# Altium project breakout_boards.PrjPcb
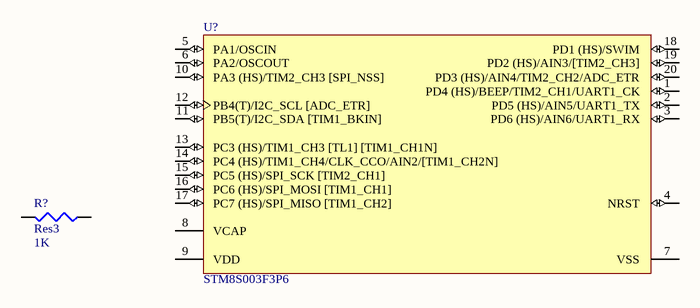
[diagram p0: Sheet1.SchDoc]
2 sheets, 3 parts. Net scope: global (net labels, ports and power ports of the same name join across sheets).
Board file: PCB1.PcbDoc
Sheets:
  Sheet1.SchDoc
  Sheet2.SchDoc

## Sheet Sheet1.SchDoc
size A4; SheetNumber: 1; SheetTotal: 2

### Parts
(Parts that share a designator on the sheet are numbered #1, #2 ... from top to bottom, then left to right.)
R?  Res3  value 1K  [J1-0603]
U?#1  STM8S003F3P6  [STM-TSSOP20_V]

### Nets

Not connected (* = marked no-connect by the designer): R? 1 2; U?#1 1(PD4_(HS)/BEEP/TIM2_CH1/UART1_CK) 2(PD5_(HS)/AIN5/UART1_TX) 3(PD6_(HS)/AIN6/UART1_RX) 4(NRST) 5(PA1/OSCIN) 6(PA2/OSCOUT) 7(VSS) 8(VCAP) 9(VDD) 10(PA3_(HS)/TIM2_CH3_[SPI_NSS]) 11(PB5(T)/I2C_SDA_[TIM1_BKIN]) 12(PB4(T)/I2C_SCL_[ADC_ETR]) 13(PC3_(HS)/TIM1_CH3_[TL1]_[TIM1_CH1N]) 14(PC4_(HS)/TIM1_CH4/CLK_CCO/AIN2/[TIM1_CH2N]) 15(PC5_(HS)/SPI_SCK_[TIM2_CH1]) 16(PC6_(HS)/SPI_MOSI_[TIM1_CH1]) 17(PC7_(HS)/SPI_MISO_[TIM1_CH2]) 18(PD1_(HS)/SWIM) 19(PD2_(HS)/AIN3/[TIM2_CH3]) 20(PD3_(HS)/AIN4/TIM2_CH2/ADC_ETR)

### Library data of the parts
R? = Res3: Resistor; Published: 8-Jun-2000; LatestRevisionDate: 29-May-2009; LatestRevisionNote: IPC-7351 Footprint Added.; PackageReference: J1-0603; Publisher: Altium Limited; PackageDescription: Chip Resistor
U?#1 = CMP-2000-07166-1: Value Line, 16 MHz STM8S 8-Bit MCU, 8 Kbyte Flash, 128 Byte Data EEPROM, 10-Bit ADC, 3 Timers, 2.95 to 5.5 V, -40 to 85 degC, 20-Pin TSSOP, RoHS, Tube; Manufacturer: STMicroelectronics; Connectivity: I²C,IrDA,LIN,SPI,UART/USART; Featured Product: FlasherSeriesofProductionTools; Program Memory Size: 8KB(8Kx8); Oscillator Type: Internal; Other Names: 497-11946-5; Core Processor: STM8; Package Version: Rev. 2, 01/2015; Peripherals: Brown-outDetect/Reset,POR,PWM,WDT; Data Converters: A/D5x10b; Other Related Documents: STM8S003F3ViewAllSpecifications; Number of I/Os: 16; EEPROM Size: 128x8; Speed: 16MHz; RAM Size: 1Kx8; Voltage - Supply (Vcc/Vdd): 2.95V~5.5V; Series: STM8S; Category: IntegratedCircuits(ICs); Program Memory Type: FLASH; Packaging: Tube; Datasheet Version: Rev. 8, 04/2016; Manufacturer URL: http://www.st.com/; Package URL: http://www.st.com/st-web-ui/static/active/en/resource/technical/document/datasheet/DM00141386.pdf; Operating Temperature: -40°C~85°C; Package / Case: 20-TSSOP(0.173",4.40mmWidth); Standard Package: 74; Family: Embedded-Microcontrollers; Datasheet URL: http://www2.st.com/content/ccc/resource/technical/document/datasheet/42/5a/27/87/ac/5a/44/88/DM00024550.pdf/files/DM00024550.pdf/jcr:content/translations/en.DM00024550.pdf; Package Description: 20-Pin Thin Shrink Small Outline Package, Body 6.5 x 4.4 mm, Pitch 0.65 mm; Core Size: 8-Bit; Package Reference: TSSOP20; Mounting Technology: SurfaceMount; Dynamic Catalog: STM8S; Number of I /O: 16

## Sheet Sheet2.SchDoc
size A4; SheetNumber: 2; SheetTotal: 2
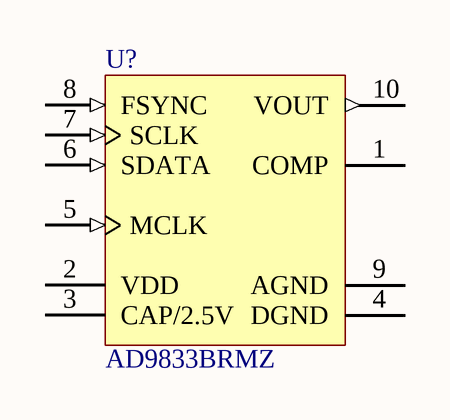
[diagram p1: Sheet2.SchDoc]

### Parts
(Parts that share a designator on the sheet are numbered #1, #2 ... from top to bottom, then left to right.)
U?#2  AD9833BRMZ  [ADI-RM-10_M]

### Nets

Not connected (* = marked no-connect by the designer): U?#2 1(COMP) 2(VDD) 3(CAP/2.5V) 4(DGND) 5(MCLK) 6(SDATA) 7(SCLK) 8(FSYNC) 9(AGND) 10(VOUT)

### Library data of the parts
U?#2 = CMP-0293-00077-1: Low Power, 12.65 mW, 2.3 V to 5.5 V, Programmable Waveform Generator, 10-Bit, Serial, RM-10, 50 Tube, Pb-Free; Resolution (Bits): 10bit; Compliance Range (V): 650mV; FS Iout (mA nom): 3mA; REFCLK Multiplier: No; Master fclk: 25MHz; I Supply total (max): 5.5mA; Tuning Word Width (bits): 28bit; Code_JEDEC: MO-187-BA; DatasheetVersion: Rev. D; PackageVersion: 5/8/2005; ComponentLink1URL: www.analog.com; ComponentLink3Description: Package Specification; PackageDescription: 10-Lead Mini Small Outline Package [MSOP]; I/O Interface: Serial; ComponentLink2Description: Datasheet; ComponentLink1Description: Manufacturer URL; PackageReference: RM-10; ComponentLink2URL: http://www.analog.com/static/imported-files/data_sheets/AD9833.pdf; ComponentLink3URL: http://www.analog.com/static/imported-files/packages/PKG_PDF/MSOP%28RM%29/RM_10.pdf